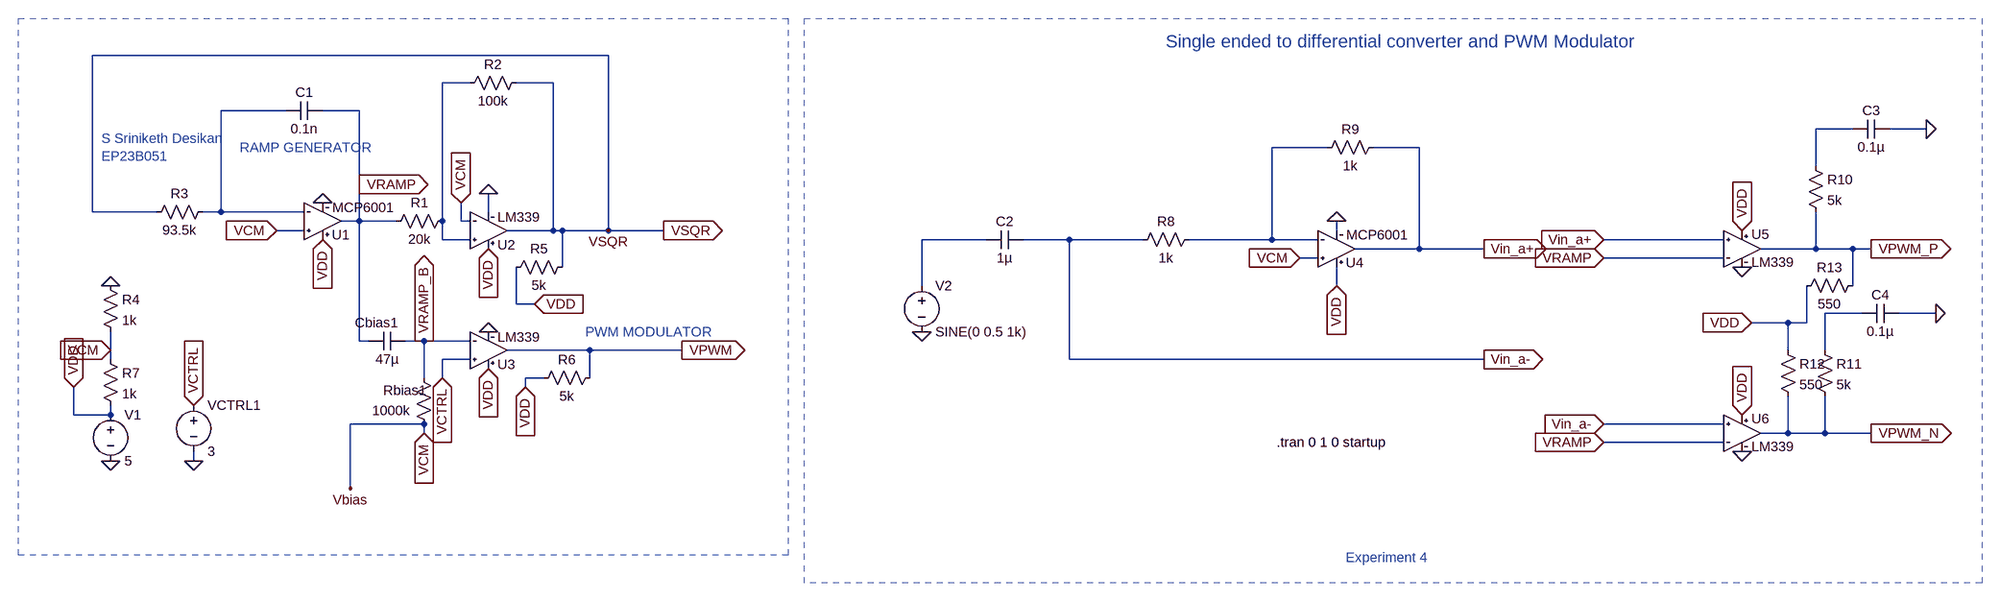
[diagram p0: schematic Experiment 4 - Single Ended to Differential Converter and PWM Modulator.asc]
Experiment 4 - Single Ended to Differential Converter and PWM Modulator.asc, the LTspice schematic file:
Version 4
SHEET 1 2340 888
WIRE -48 -32 -944 -32
WIRE -288 16 -336 16
WIRE -144 16 -208 16
WIRE -608 64 -720 64
WIRE -480 64 -544 64
WIRE 2112 96 2048 96
WIRE 2240 96 2176 96
WIRE 1200 128 1104 128
WIRE 1360 128 1280 128
WIRE 2048 160 2048 96
WIRE -480 192 -480 64
WIRE -944 240 -944 -32
WIRE -832 240 -944 240
WIRE -720 240 -720 64
WIRE -720 240 -752 240
WIRE -576 240 -720 240
WIRE -256 240 -256 208
WIRE -480 256 -480 192
WIRE -480 256 -512 256
WIRE -416 256 -480 256
WIRE -336 256 -336 16
WIRE -304 256 -304 224
WIRE -288 256 -304 256
WIRE -576 272 -624 272
WIRE -144 272 -144 16
WIRE -144 272 -224 272
WIRE -128 272 -144 272
WIRE -48 272 -48 -32
WIRE -48 272 -128 272
WIRE 48 272 -48 272
WIRE 1216 272 1216 256
WIRE -336 288 -336 256
WIRE -288 288 -336 288
WIRE 608 288 496 288
WIRE 752 288 672 288
WIRE 880 288 752 288
WIRE 1104 288 1104 128
WIRE 1104 288 960 288
WIRE 1184 288 1104 288
WIRE 1888 288 1680 288
WIRE 1360 304 1360 128
WIRE 1360 304 1248 304
WIRE 1472 304 1360 304
WIRE 2048 304 2048 240
WIRE 2048 304 1952 304
WIRE 2112 304 2048 304
WIRE 2144 304 2112 304
WIRE 1184 320 1152 320
WIRE 1888 320 1680 320
WIRE -128 336 -128 272
WIRE 496 368 496 288
WIRE 1216 368 1216 336
WIRE 2112 368 2112 304
WIRE -208 400 -208 336
WIRE -176 400 -208 400
WIRE 2128 416 2064 416
WIRE 2256 416 2192 416
WIRE 2000 432 1936 432
WIRE 2032 432 2032 368
WIRE 2032 432 2000 432
WIRE -480 464 -480 256
WIRE -464 464 -480 464
WIRE -368 464 -400 464
WIRE -288 464 -368 464
WIRE -912 480 -912 448
WIRE -80 480 -224 480
WIRE 80 480 -80 480
WIRE 2000 480 2000 432
WIRE 2064 480 2064 416
WIRE -912 496 -912 480
WIRE -288 496 -336 496
WIRE 752 496 752 288
WIRE 1472 496 752 496
WIRE -368 528 -368 464
WIRE -336 528 -336 496
WIRE -160 528 -192 528
WIRE -80 528 -80 480
WIRE -192 544 -192 528
WIRE -976 592 -976 544
WIRE -912 592 -912 576
WIRE -912 592 -976 592
WIRE -368 608 -496 608
WIRE 1888 608 1680 608
WIRE -368 624 -368 608
WIRE 2000 624 2000 560
WIRE 2000 624 1952 624
WIRE 2064 624 2064 560
WIRE 2064 624 2000 624
WIRE 2144 624 2064 624
WIRE 1888 640 1680 640
WIRE -768 672 -768 656
WIRE -496 720 -496 608
FLAG -912 480 VCM
IOPIN -912 480 In
FLAG -368 464 VRAMP_B
IOPIN -368 464 Out
FLAG -48 272 VSQR
FLAG -768 672 0
FLAG -768 576 VCTRL
IOPIN -768 576 In
FLAG -912 672 0
FLAG -624 272 VCM
IOPIN -624 272 In
FLAG -304 224 VCM
IOPIN -304 224 In
FLAG 80 480 VPWM
IOPIN 80 480 Out
FLAG -480 192 VRAMP
IOPIN -480 192 Out
FLAG -336 528 VCTRL
IOPIN -336 528 In
FLAG -912 368 0
FLAG 48 272 VSQR
IOPIN 48 272 Out
FLAG -544 224 0
FLAG -256 208 0
FLAG -256 448 0
FLAG -544 288 VDD
IOPIN -544 288 In
FLAG -256 304 VDD
IOPIN -256 304 In
FLAG -256 512 VDD
IOPIN -256 512 In
FLAG -176 400 VDD
IOPIN -176 400 In
FLAG -192 544 VDD
IOPIN -192 544 In
FLAG -976 544 VDD
IOPIN -976 544 In
FLAG -368 624 VCM
IOPIN -368 624 In
FLAG -496 720 Vbias
FLAG 1216 368 VDD
IOPIN 1216 368 In
FLAG 1216 256 0
FLAG 1472 304 Vin_a+
IOPIN 1472 304 Out
FLAG 1472 496 Vin_a-
IOPIN 1472 496 Out
FLAG 1152 320 VCM
IOPIN 1152 320 In
FLAG 1680 288 Vin_a+
IOPIN 1680 288 In
FLAG 1680 608 Vin_a-
IOPIN 1680 608 In
FLAG 1680 640 VRAMP
IOPIN 1680 640 In
FLAG 1680 320 VRAMP
IOPIN 1680 320 In
FLAG 1920 656 0
FLAG 1920 336 0
FLAG 1920 272 VDD
IOPIN 1920 272 In
FLAG 1920 592 VDD
IOPIN 1920 592 In
FLAG 2144 304 VPWM_P
IOPIN 2144 304 Out
FLAG 2144 624 VPWM_N
IOPIN 2144 624 Out
FLAG 496 448 0
FLAG 2240 96 0
FLAG 2256 416 0
FLAG 1936 432 VDD
IOPIN 1936 432 In
SYMBOL Res -320 240 R90
WINDOW 0 0 56 VBottom 2
WINDOW 3 32 56 VTop 2
SYMATTR InstName R1
SYMATTR Value 20k
SYMBOL Res -192 0 R90
WINDOW 0 0 56 VBottom 2
WINDOW 3 32 56 VTop 2
SYMATTR InstName R2
SYMATTR Value 100k
SYMBOL Res -736 224 R90
WINDOW 0 0 56 VBottom 2
WINDOW 3 32 56 VTop 2
SYMATTR InstName R3
SYMATTR Value 93.5k
SYMBOL Cap -544 48 R90
WINDOW 0 0 32 VBottom 2
WINDOW 3 32 32 VTop 2
SYMATTR InstName C1
SYMATTR Value 0.1n
SYMBOL Cap -400 448 R90
WINDOW 0 0 50 VBottom 2
WINDOW 3 32 32 VTop 2
SYMATTR InstName Cbias1
SYMATTR Value 47µ
SYMBOL Voltage -768 560 R0
SYMATTR InstName VCTRL1
SYMATTR Value 3
SYMBOL Res -928 352 R0
SYMATTR InstName R4
SYMATTR Value 1k
SYMBOL Res -384 512 R0
WINDOW 0 -55 38 Left 2
WINDOW 3 -74 73 Left 2
SYMATTR InstName Rbias1
SYMATTR Value 1000k
SYMBOL Voltage -912 576 R0
SYMATTR InstName V1
SYMATTR Value 5
SYMBOL MCP6001 -544 256 M180
SYMATTR InstName U1
SYMBOL LM339 -224 272 M180
SYMATTR InstName U2
SYMBOL LM339 -224 480 M180
SYMATTR InstName U3
SYMBOL Res -112 320 R90
WINDOW 0 0 56 VBottom 2
WINDOW 3 32 56 VTop 2
SYMATTR InstName R5
SYMATTR Value 5k
SYMBOL Res -64 512 R90
WINDOW 0 0 56 VBottom 2
WINDOW 3 32 56 VTop 2
SYMATTR InstName R6
SYMATTR Value 5k
SYMBOL Res -928 480 R0
SYMATTR InstName R7
SYMATTR Value 1k
SYMBOL Voltage 496 352 R0
SYMATTR InstName V2
SYMATTR Value SINE(0 0.5 1k)
SYMBOL Cap 672 272 R90
WINDOW 0 0 32 VBottom 2
WINDOW 3 32 32 VTop 2
SYMATTR InstName C2
SYMATTR Value 1µ
SYMBOL Res 976 272 R90
WINDOW 0 0 56 VBottom 2
WINDOW 3 32 56 VTop 2
SYMATTR InstName R8
SYMATTR Value 1k
SYMBOL Res 1296 112 R90
WINDOW 0 0 56 VBottom 2
WINDOW 3 32 56 VTop 2
SYMATTR InstName R9
SYMATTR Value 1k
SYMBOL MCP6001 1216 304 M180
SYMATTR InstName U4
SYMBOL LM339 1952 304 R0
SYMATTR InstName U5
SYMBOL LM339 1952 624 R0
SYMATTR InstName U6
SYMBOL Res 2032 144 R0
SYMATTR InstName R10
SYMATTR Value 5k
SYMBOL Cap 2176 80 R90
WINDOW 0 0 32 VBottom 2
WINDOW 3 32 32 VTop 2
SYMATTR InstName C3
SYMATTR Value 0.1µ
SYMBOL Res 2048 464 R0
SYMATTR InstName R11
SYMATTR Value 5k
SYMBOL Cap 2192 400 R90
WINDOW 0 0 32 VBottom 2
WINDOW 3 32 32 VTop 2
SYMATTR InstName C4
SYMATTR Value 0.1µ
SYMBOL Res 1984 464 R0
SYMATTR InstName R12
SYMATTR Value 550
SYMBOL Res 2128 352 R90
WINDOW 0 0 56 VBottom 2
WINDOW 3 32 56 VTop 2
SYMATTR InstName R13
SYMATTR Value 550
TEXT -688 128 Left 2 ;RAMP GENERATOR
TEXT -88 448 Left 2 ;PWM MODULATOR
TEXT 1112 640 Left 2 !.tran 0 1 0 startup
TEXT -928 112 Left 2 ;S Sriniketh Desikan\nEP23B051
TEXT 920 -56 Left 3 ;Single ended to differential converter and PWM Modulator
TEXT 1232 840 Left 2 ;Experiment 4
RECTANGLE Normal -1072 -96 264 836 2
RECTANGLE Normal 292 -96 2336 884 2

The netlist it stands for:
* Experiment 4 - Single Ended to Differential Converter and PWM Modulator.asc
R1 N001 VRAMP 20k
R2 VSQR N001 100k
R3 N002 VSQR 93.5k
C1 VRAMP N002 0.1n
Cbias1 VRAMP_B VRAMP 47µ
VCTRL1 VCTRL 0 3
R4 0 Vbias 1k
Rbias1 VRAMP_B Vbias 1000k
V1 VDD 0 5
XU1 Vbias N002 VDD 0 VRAMP MCP6001
XU2 N001 Vbias VDD 0 VSQR LM339
XU3 VCTRL VRAMP_B VDD 0 VPWM LM339
R5 VSQR VDD 5k
R6 VPWM VDD 5k
R7 Vbias VDD 1k
V2 N005 0 SINE(0 0.5 1k)
C2 Vin_a- N005 1µ
R8 N004 Vin_a- 1k
R9 Vin_a+ N004 1k
XU4 Vbias N004 VDD 0 Vin_a+ MCP6001
XU5 Vin_a+ VRAMP VDD 0 VPWM_P LM339
XU6 Vin_a- VRAMP VDD 0 VPWM_N LM339
R10 N003 VPWM_P 5k
C3 0 N003 0.1µ
R11 N006 VPWM_N 5k
C4 0 N006 0.1µ
R12 VDD VPWM_N 550
R13 VPWM_P VDD 550
* RAMP GENERATOR
* PWM MODULATOR
.tran 0 1 0 startup
* S Sriniketh Desikan
* EP23B051
* Single ended to differential converter and PWM Modulator
* Experiment 4
.lib ./MCP6001.lib
.lib ./LM339.lib
.backanno
.end